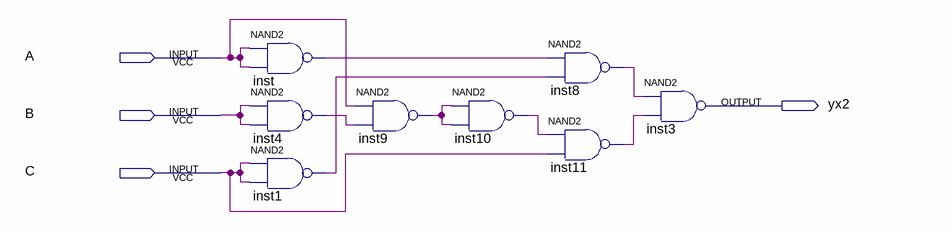
[diagram p0: schematic sheet]
// Quartus schematic DZ1_Quartus_decoder_yx2.bdf as structural Verilog: 8 symbols, 4 pins
module DZ1_Quartus_decoder_yx2 (
  input  A,
  input  B,
  input  C,
  output yx2
);

  wire inst1_out, inst4_out, inst8_out, inst9_out, inst10_out, inst11_out, inst_out;

  nand inst (inst_out, A, A);
  nand inst4 (inst4_out, B, B);
  nand inst1 (inst1_out, C, C);
  nand inst9 (inst9_out, A, inst4_out);
  nand inst10 (inst10_out, inst9_out, inst9_out);
  nand inst8 (inst8_out, inst_out, inst1_out);
  nand inst11 (inst11_out, inst10_out, C);
  nand inst3 (yx2, inst8_out, inst11_out);
endmodule
